# EAGLE schematic Drum_robo (EAGLE 8.2.2)
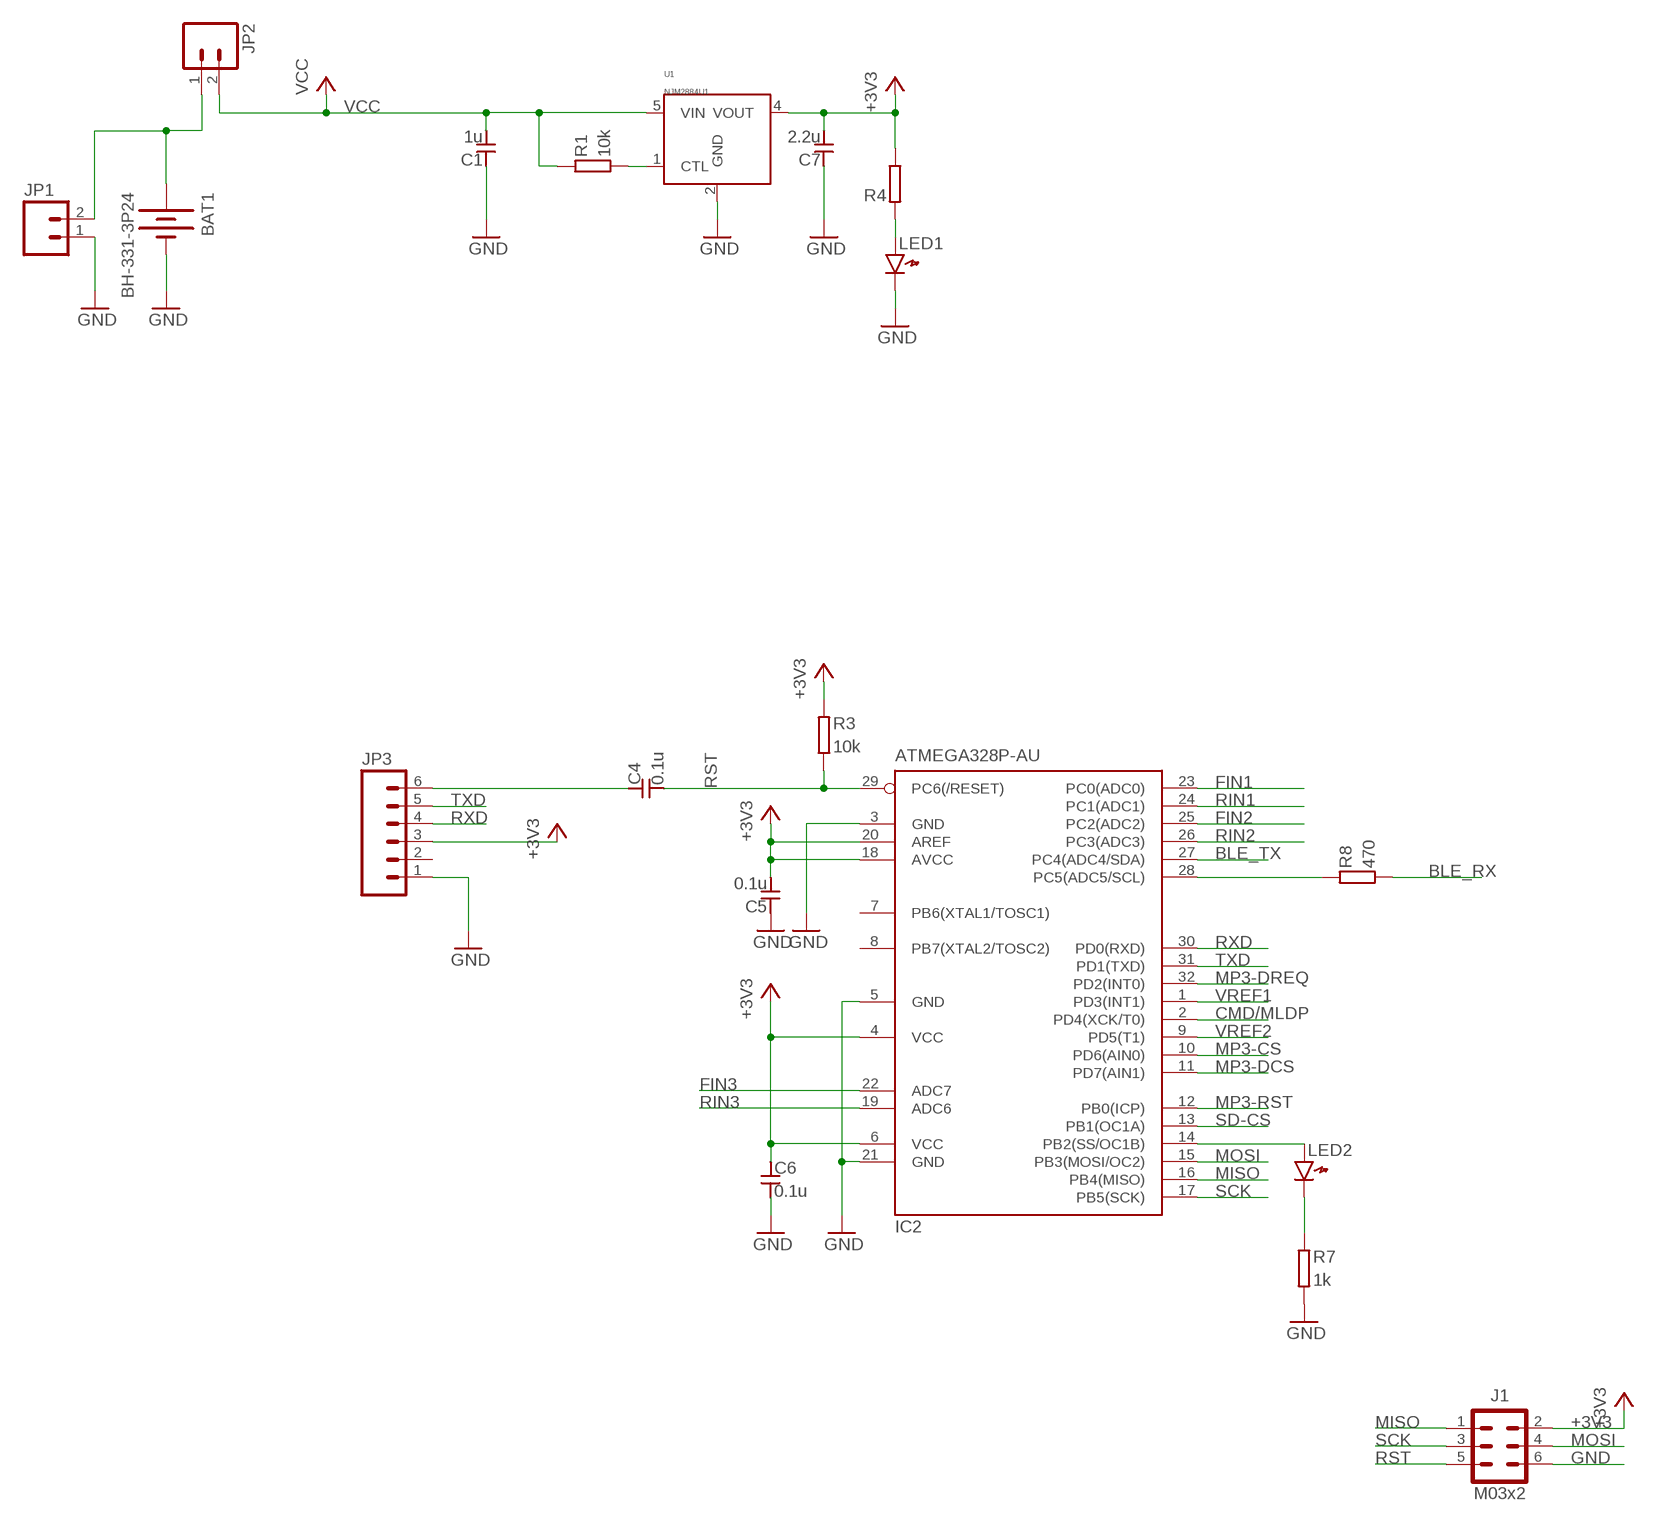
[diagram p0: schematic, sheet 1, part 1 of 2]
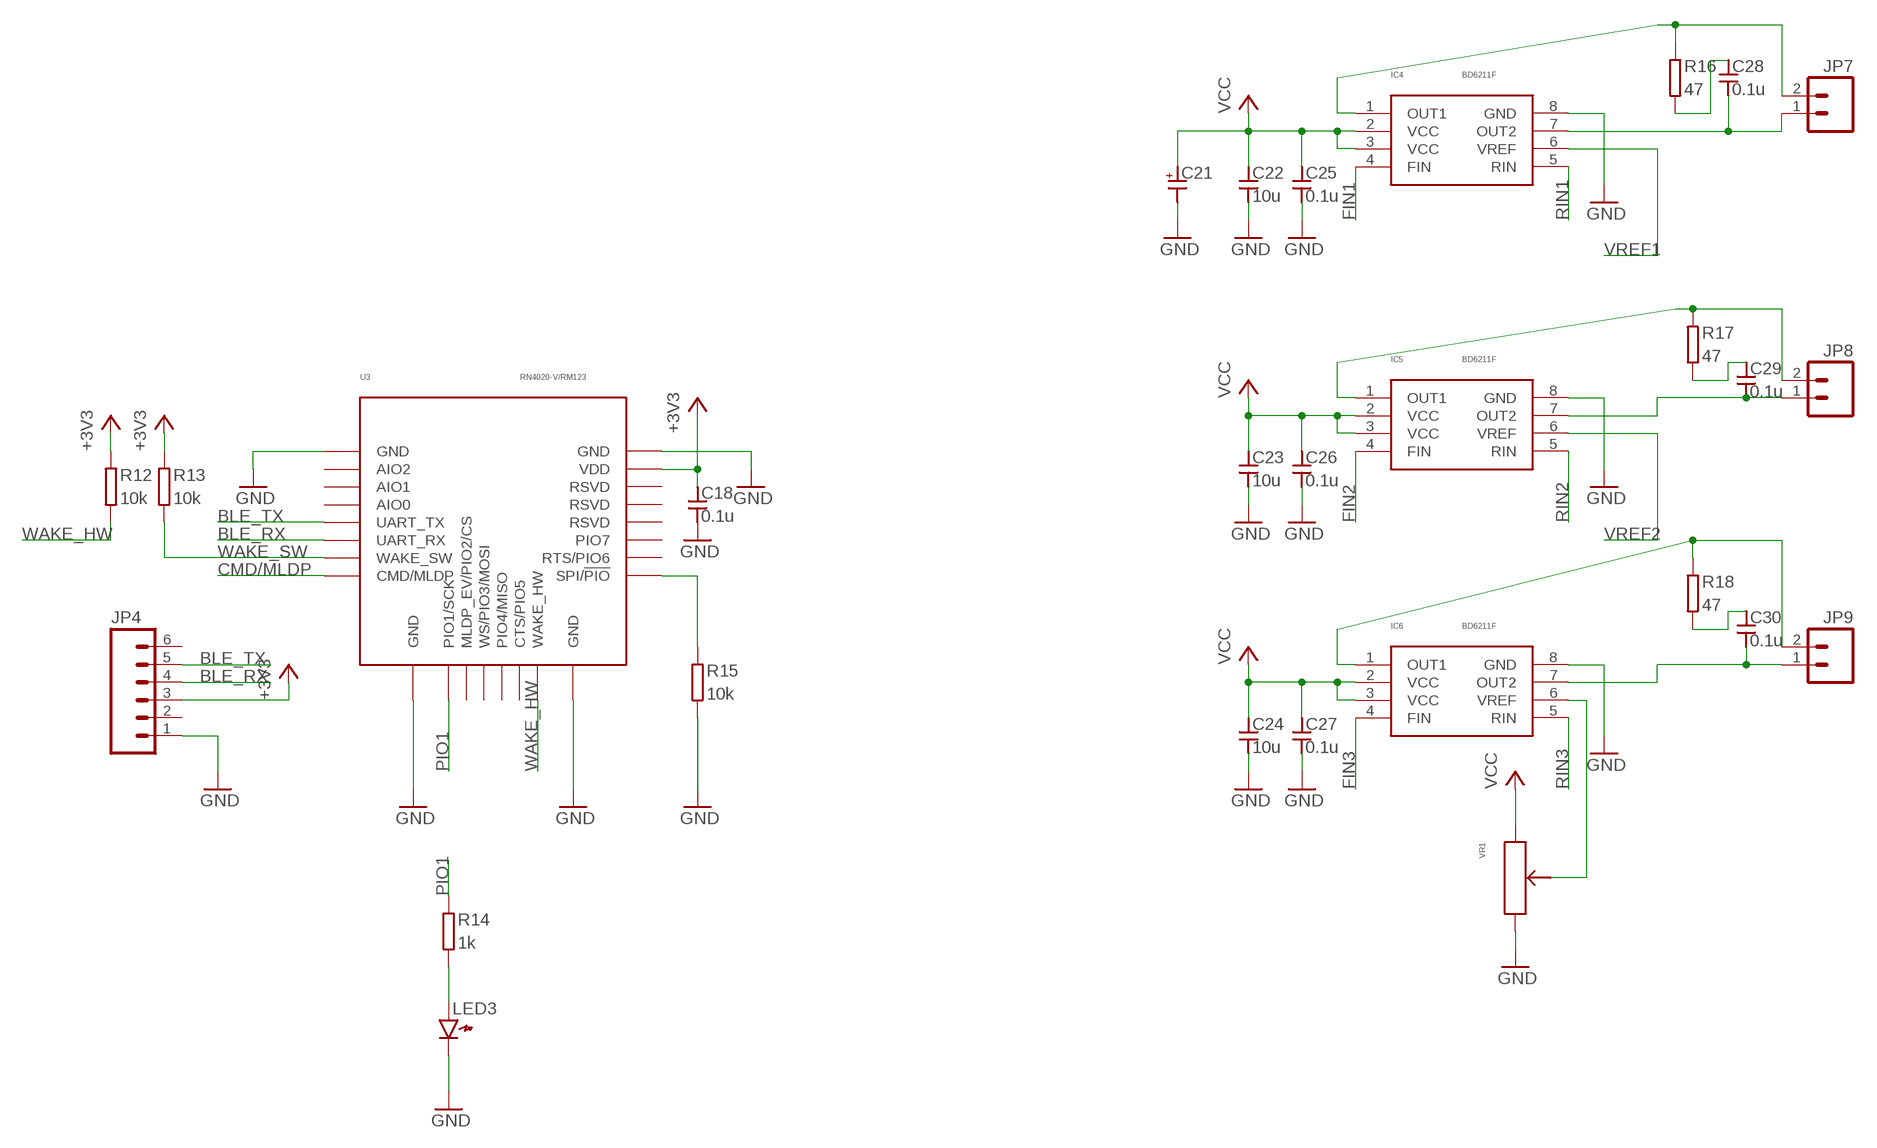
[diagram p1: schematic, sheet 1, part 2 of 2]

## Parts
BAT1  BH-331-3P24  [BH-331-3P24]
C1  1u  CAPACITOR1608_REDUCED  [SMD1608_REDUCED]
C4  0.1u  CAPACITOR1608_REDUCED  [SMD1608_REDUCED]
C5  0.1u  CAPACITOR1608_REDUCED  [SMD1608_REDUCED]
C6  0.1u  CAPACITOR1608_REDUCED  [SMD1608_REDUCED]
C7  2.2u  CAPACITOR1608_REDUCED  [SMD1608_REDUCED]
C18  0.1u  CAPACITOR1608_REDUCED  [SMD1608_REDUCED]
C21  CAPACITOR-POLPANASONIC_D  [PANASONIC_D]
C22  10u  CAPACITOR2012_REDUCED  [SMD2012_REDUCED]
C23  10u  CAPACITOR2012_REDUCED  [SMD2012_REDUCED]
C24  10u  CAPACITOR2012_REDUCED  [SMD2012_REDUCED]
C25  0.1u  CAPACITOR1608_REDUCED  [SMD1608_REDUCED]
C26  0.1u  CAPACITOR1608_REDUCED  [SMD1608_REDUCED]
C27  0.1u  CAPACITOR1608_REDUCED  [SMD1608_REDUCED]
C28  0.1u  CAPACITOR1608_REDUCED  [SMD1608_REDUCED]
C29  0.1u  CAPACITOR1608_REDUCED  [SMD1608_REDUCED]
C30  0.1u  CAPACITOR1608_REDUCED  [SMD1608_REDUCED]
IC2  ATMEGA328P-AU  [TQFP32-08]
IC4  BD6211F  [SOP-8]
IC5  BD6211F  [SOP-8]
IC6  BD6211F  [SOP-8]
J1  M03X2STD  [2X03]
JP1  M02NOSILK  [1X02-NOSILK]
JP2  M02NOSILK  [1X02-NOSILK]
JP3  M06NOSILK  [1X06-NOSILK]
JP4  M06NOSILK  [1X06-NOSILK]
JP7  M02NOSILK  [1X02-NOSILK]
JP8  M02NOSILK  [1X02-NOSILK]
JP9  M02NOSILK  [1X02-NOSILK]
LED1  LED1608_REDUCED  [LED1608_REDUCED]
LED2  LED1608_REDUCED  [LED1608_REDUCED]
LED3  LED1608_REDUCED  [LED1608_REDUCED]
R1  10k  RESISTOR1608_REDUCED  [SMD1608_REDUCED]
R3  10k  RESISTOR1608_REDUCED  [SMD1608_REDUCED]
R4  RESISTOR1608_REDUCED  [SMD1608_REDUCED]
R7  1k  RESISTOR1608_REDUCED  [SMD1608_REDUCED]
R8  470  RESISTOR1608_REDUCED  [SMD1608_REDUCED]
R12  10k  RESISTOR1608_REDUCED  [SMD1608_REDUCED]
R13  10k  RESISTOR1608_REDUCED  [SMD1608_REDUCED]
R14  1k  RESISTOR1608_REDUCED  [SMD1608_REDUCED]
R15  10k  RESISTOR1608_REDUCED  [SMD1608_REDUCED]
R16  47  RESISTOR1608_REDUCED  [SMD1608_REDUCED]
R17  47  RESISTOR1608_REDUCED  [SMD1608_REDUCED]
R18  47  RESISTOR1608_REDUCED  [SMD1608_REDUCED]
U1  NJM2884U1  [SOT-89-5]
U3  RN4020-V/RM123  [RN4020]
VR1  VR  [3362P]

## Nets
+3V3: C5.2 C6.1 C7.2 C18.1 IC2.4(VCC) IC2.6(VCC) IC2.18(AVCC) IC2.20(AREF) J1.2 JP3.3 JP4.3 R3.1 R4.2 R12.1 R13.1 U1.4(VOUT) U3.23(VDD)
BLE_RX: JP4.4 R8.2 U3.6(UART_RX)
BLE_TX: IC2.27(PC4(ADC4/SDA)) JP4.5 U3.5(UART_TX)
CMD/MLDP: IC2.2(PD4(XCK/T0)) U3.8(CMD/MLDP)
FIN1: IC2.23(PC0(ADC0)) IC4.4(FIN)
FIN2: IC2.25(PC2(ADC2)) IC5.4(FIN)
FIN3: IC2.22(ADC7) IC6.4(FIN)
GND: BAT1.- C1.1 C5.1 C6.2 C7.1 C18.2 C21.- C22.2 C23.2 C24.2 C25.2 C26.2 C27.2 IC2.3(GND) IC2.5(GND) IC2.21(GND) IC4.8(GND) IC5.8(GND) IC6.8(GND) J1.6 JP1.1 JP3.1 JP4.1 LED1.K LED3.K R7.2 R15.2 U1.2(GND) U3.1(GND) U3.9(GND) U3.16(GND) U3.24(GND) VR1.3
MISO: IC2.16(PB4(MISO)) J1.1
MOSI: IC2.15(PB3(MOSI/OC2)) J1.4
MP3-CS: IC2.10(PD6(AIN0))
MP3-DCS: IC2.11(PD7(AIN1))
MP3-DREQ: IC2.32(PD2(INT0))
MP3-RST: IC2.12(PB0(ICP))
N$1: IC2.14(PB2(SS/OC1B)) LED2.A
N$2: C4.1 JP3.6
N$3: LED3.A R14.2
N$4: IC2.28(PC5(ADC5/SCL)) R8.1
N$5: IC6.1(OUT1) JP9.2 R18.1
N$11: R15.1 U3.17(SPI/!PIO)
N$13: BAT1.+ JP1.2 JP2.1
N$18: R1.2 U1.1(CTL)
N$20: C30.2 IC6.7(OUT2) JP9.1
N$21: IC6.6(VREF) VR1.2
N$25: C28.1 R16.2
N$26: C29.1 R17.2
N$27: C30.1 R18.2
N$31: LED1.A R4.1
N$37: IC5.1(OUT1) JP8.2 R17.1
N$38: C29.2 IC5.7(OUT2) JP8.1
N$39: IC4.1(OUT1) JP7.2 R16.1
N$40: C28.2 IC4.7(OUT2) JP7.1
PIO1: R14.1 U3.10(PIO1/SCK)
RIN1: IC2.24(PC1(ADC1)) IC4.5(RIN)
RIN2: IC2.26(PC3(ADC3)) IC5.5(RIN)
RIN3: IC2.19(ADC6) IC6.5(RIN)
RST: C4.2 IC2.29(PC6(/RESET)) J1.5 R3.2
RXD: IC2.30(PD0(RXD)) JP3.4
SCK: IC2.17(PB5(SCK)) J1.3
SD-CS: IC2.13(PB1(OC1A))
SHUTDOWN: LED2.K R7.1
TXD: IC2.31(PD1(TXD)) JP3.5
VCC: C1.2 C21.+ C22.1 C23.1 C24.1 C25.1 C26.1 C27.1 IC4.2(VCC) IC4.3(VCC) IC5.2(VCC) IC5.3(VCC) IC6.2(VCC) IC6.3(VCC) JP2.2 R1.1 U1.5(VIN) VR1.1
VREF1: IC2.1(PD3(INT1)) IC4.6(VREF)
VREF2: IC2.9(PD5(T1)) IC5.6(VREF)
WAKE_HW: R12.2 U3.15(WAKE_HW)
WAKE_SW: R13.2 U3.7(WAKE_SW)
Unconnected: IC2.7(PB6(XTAL1/TOSC1)) IC2.8(PB7(XTAL2/TOSC2)) JP3.2 JP4.2 JP4.6 U3.2(AIO2) U3.3(AIO1) U3.4(AIO0) U3.11(MLDP_EV/PIO2/CS) U3.12(WS/PIO3/MOSI) U3.13(PIO4/MISO) U3.14(CTS/PIO5) U3.18(RTS/PIO6) U3.19(PIO7) U3.20(RSVD) U3.21(RSVD) U3.22(RSVD)

## Library data of the parts
BAT1 = battery:BH-331-3P24
C1 C4-C7 C18 C22-C30 = generic:CAPACITOR: Generic Capacitor
C21 = generic:CAPACITOR-POL: Generic Capacitor with Polarity
IC2 = AVR:ATMEGA328P-AU: AVR ATMEGA328P-AU AKIZUKI CODE I-04386
IC4-IC6 = motor_driver:BD6211: ROHM Motor driver
J1 = header:M03X2
JP1 JP2 JP7-JP9 = header:M02
JP3 JP4 = header:M06
LED1-LED3 = generic:LED: Generic LEDs
R1 R3 R4 R7 R8 R12-R18 = generic:RESISTOR: Generic Registor
U1 = LDO:NJM2884U1: JRC LDO Io(max ) = 500mA akizuki : I-10896
U3 = com_module:RN4020: Bluetooth Low Energy Module Microchip
VR1 = VR:VR